# Altium project USB-UART.PrjPcb
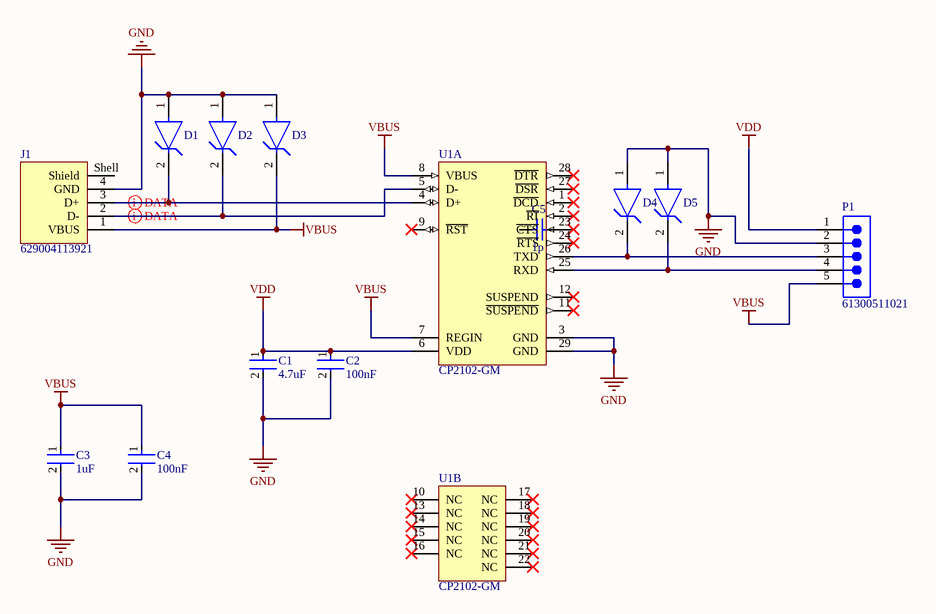
[diagram p0: Schematic.SchDoc]
1 sheet, 13 parts. Net scope: global (net labels, ports and power ports of the same name join across sheets).
Board file: PCB1.PcbDoc

## Sheet Schematic.SchDoc
size A; SheetNumber: 1; SheetTotal: 1

### Parts
C1  4.7uF  [FP-GRM155-0_1-IPC_B]
C2  100nF  [FP-GRM033-0_03-MFG]
C3  1uF  [FP-GRM15-0_1-MFG]
C4  100nF  [FP-GRM033-0_03-MFG]
C5  value 1p  (hidden comment: Capacitor)
D1  UCLAMP3601P.TNT  [FP-SLP1006P2-MFG]  (value not drawn)
D2  UCLAMP3601P.TNT  [FP-SLP1006P2-MFG]  (value not drawn)
D3  UCLAMP3601P.TNT  [FP-SLP1006P2-MFG]  (value not drawn)
D4  UCLAMP3601P.TNT  [FP-SLP1006P2-MFG]  (value not drawn)
D5  UCLAMP3601P.TNT  [FP-SLP1006P2-MFG]  (value not drawn)
J1  629004113921  [629004113921]
P1  61300511021  [61300511021]
U1  CP2102-GM  [SLAB-QFN-28-3125x3125TP_N]  (parts A,B of 2)

### Nets
GND: C1.2 C2.2 C3.2 C4.2 D1.1(A) D2.1(A) D3.1(A) D4.1(A) D5.1(A) J1.4(GND) P1.2 U1.3(GND) U1.29(GND)
VBUS: C3.1 C4.1 D3.2(C) J1.1(VBUS) P1.5 U1.7(REGIN) U1.8(VBUS)
VDD: C1.1 C2.1 P1.1 U1.6(VDD)
NetD1_2: D1.2(C) J1.3(D+) U1.4(D+)
NetD2_2: D2.2(C) J1.2(D-) U1.5(D-)
NetD4_2: D4.2(C) P1.3 U1.26(TXD)
NetD5_2: D5.2(C) P1.4 U1.25(RXD)

Not connected (* = marked no-connect by the designer): C5 1 2; J1 Shell(Shield); U1 1(~{DCD})* 2(~{RI})* 9(~{RST})* 10(NC)* 11(~{SUSPEND})* 12(SUSPEND)* 13(NC)* 14(NC)* 15(NC)* 16(NC)* 17(NC)* 18(NC)* 19(NC)* 20(NC)* 21(NC)* 22(NC)* 23(~{CTS})* 24(~{RTS})* 27(~{DSR})* 28(~{DTR})*

### Layout directives
differential pair: NetD1_2, NetD2_2

### Library data of the parts
C1 = CMP-2008-04549-2: Chip Multilayer Ceramic Capacitors for General Purpose, 0402, 4.7uF, X5R, 15%, 20%, 6.3V; Height: 0.5mm; Weight: 0.000212oz; Length: 1mm; Case Code (Metric): 1005; Packaging: Tape and Reel; Termination: SMD/SMT; Dielectric: X5R; Depth: 0.5mm; Case Code (Imperial): 0402; Min Operating Temperature: -55°C; Case/Package: 0402; Voltage: 6.3V; Width: 0.02inch; Capacitance: 4.7uF; Lead Free: Lead Free; Thickness: 0.022inch; Contact Plating: Tin; REACH SVHC: No SVHC; Package Quantity: 10000; Tolerance: 20%; Voltage Rating (DC): 6.3V; Voltage Rating: 6.3V; Mount: Surface Mount; Max Operating Temperature: 85°C
C2 C4 = CMP-06035-000062-2: Chip Multilayer Ceramic Capacitors for General Purpose, 0201, 0.10uF, X5R, 15%, 10%, 6.3V; Min Operating Temperature: -55°C; Lead Free: Lead Free; Radiation Hardening: No; Dielectric: X5R; Voltage Rating (DC): 6.3V; REACH SVHC: No SVHC; Case/Package: 0201; Voltage Rating: 6.3V; Length: 0.6mm; Max Operating Temperature: 85°C; Width: 0.012inch; Depth: 0.3mm; Material: Ceramic; Case Code (Metric): 0603; Thickness: 0.013inch; Packaging: Tape and Reel; Height: 0.3mm; Capacitance: 100nF; Weight: 6E-06oz; Package Quantity: 1; Mount: Surface Mount; Voltage: 6.3V; Case Code (Imperial): 0201; Tolerance: 10%; Termination: SMD/SMT
C3 = CMP-2008-04556-2: CAP CER 1UF 10V X5R 0402; Manufacturer Part Number: GRM155R61A105KE15D; Manufacturer: Murata; Material: Ceramic; Tolerance: 10%; Temperature Coefficient: 15%; Description: 1µF ±10% 10V Ceramic Capacitor X5R 0402 (1005 Metric); Octopart: https://octopart.com/grm155r61a105ke15d-murata-197442; Lead Free: Yes; ComponentLink2Description: Datasheet; Temperature: -55°C to +85°C; Temperature Range High: +85°C; Height: 0.55mm; Capacitance: 1uF; Ipc Land Pattern Name: CAPC10050X50; ComponentLink2URL: https://search.murata.co.jp/Ceramy/image/img/A01X/G101/ENG/GRM155R61A105KE15-01A.pdf; Temperature Range Low: -55°C; Device Class L2: Capacitors; Voltage Rating: 10V; RoHS: TRUE; Device Class L1: Passive Components; Device Class L3: Ceramic Capacitors; Temperature Characteristic: X5R; Mouser Description: 0402 1 uF 10 V ±10% Tolerance X5R Surface Mount Multilayer Ceramic Capacitor; Automotive: No; Package: GRM15-0.1; Digikey Description: CAP CER 1UF 10V X5R 0402; Value: 1uF; Category: Cap
C5 = Capacitor: SimulationGenericComponent: True
D1-D5 = CMP-56445-000005-1: TVS DIODE 33VWM 60VC SLP1006P2; Direction: Unidirectional; Min Breakdown Voltage: 36V; Leakage Current: 1uA; Peak Pulse Power: 125W; Power Line Protection: No; Number of Unidirectional Channels: 1; Clamping Voltage: 60V; Peak Pulse Current: 2A; Power Dissipation: 170W; Diode Type: ZENER; Element Configuration: Single; Reverse Standoff Voltage: 33V; Max Breakdown Voltage: 45V; Max Operating Temperature: 125°C; Resistor Type: Zener; Series: Automotive, AEC-Q100, uClamp®; Min Operating Temperature: -40°C; Case Code (Imperial): 0402; Number of Pins: 2; Lead Free: Lead Free; Case/Package: SMD/SMT; RoHS Compliant: Yes; Packaging: Tape and Reel; Clamping Voltage-Max: 60V; Depth: 0.6mm; Case Code (Metric): 1006; Length: 1mm; Radiation Hardening: No; Mount: Surface Mount; Working Voltage: 33V
J1 = CMP-1502-03242-2: NexarPartId: 19991169; USB Standard: USB 2.0; Gender: Male; Connector Type: USB; Contact Resistance: 20mΩ; Current Rating: 1.5A; Number of Contacts: 4; Insulation Resistance: 1GΩ; Operating Supply Voltage: 30V; Termination: SMD/SMT; Lead Free: Lead Free; Max Operating Temperature: 105°C; Mount: Horizontal, Surface Mount; Features: Shielded; Orientation: Horizontal; Length: 18.8mm; REACH SVHC: Unknown; Min Operating Temperature: -40°C; Contact Plating: Gold; Number of Pins: 4; RoHS: Compliant
P1 = CMP-1502-01067-2: NexarPartId: 32855525; Pitch: 2.54mm; Operating Supply Voltage: 250V; Number of Contacts: 5; Connector Type: Male Pin; Gender: Male; Contact Resistance: 20mΩ; Current Rating: 3A; Contact Material: Copper; Termination: Solder; Packaging: Bulk; Contact Mating Length: 5.9944mm; Number of Pins: 5; Number of Positions: 5; RoHS: Compliant; Contact Plating: Gold; Mount: Through Hole; REACH SVHC: Unknown; Color: Black; Lead Pitch: 2.54mm; Number of Rows: 1
U1 = CMP-0511-00012-1: Single-Chip USB to UART Bridge, 1024 Bytes EEPROM, -40 to 85 degC, 28-pin QFN, Tube; Manufacturer: Silicon Labs; Internal Oscillator: TRUE; Sub-Family: USB Bridges; ComponentLink3Description: Package Specification; PackageDescription: 28-Pin Quad-Flat No-Leads Package, Body 5 x 5 mm, Pitch 0.5 mm; PartNumber: CP2102-GM; EEPROM: 1024 Bytes; Mounting Technology: Surface Mount; ComponentLink2URL: http://www.silabs.com/Support%20Documents/TechnicalDocs/CP2102-9.pdf; DatasheetVersion: Rev. 1.5; ComponentLink1URL: http://www.silabs.com/; ComponentLink2Description: Datasheet; Code_JEDEC: MO-220; PackageReference: QFN-28; Code_IPC: J-STD-020C; ComponentLink3URL: http://www.silabs.com/Support%20Documents/TechnicalDocs/C8051T61x.pdf; ComponentLink1Description: Manufacturer URL